# EAGLE schematic TakpadV6.1 (EAGLE 8.4.0)

## Sheet 1 of 2
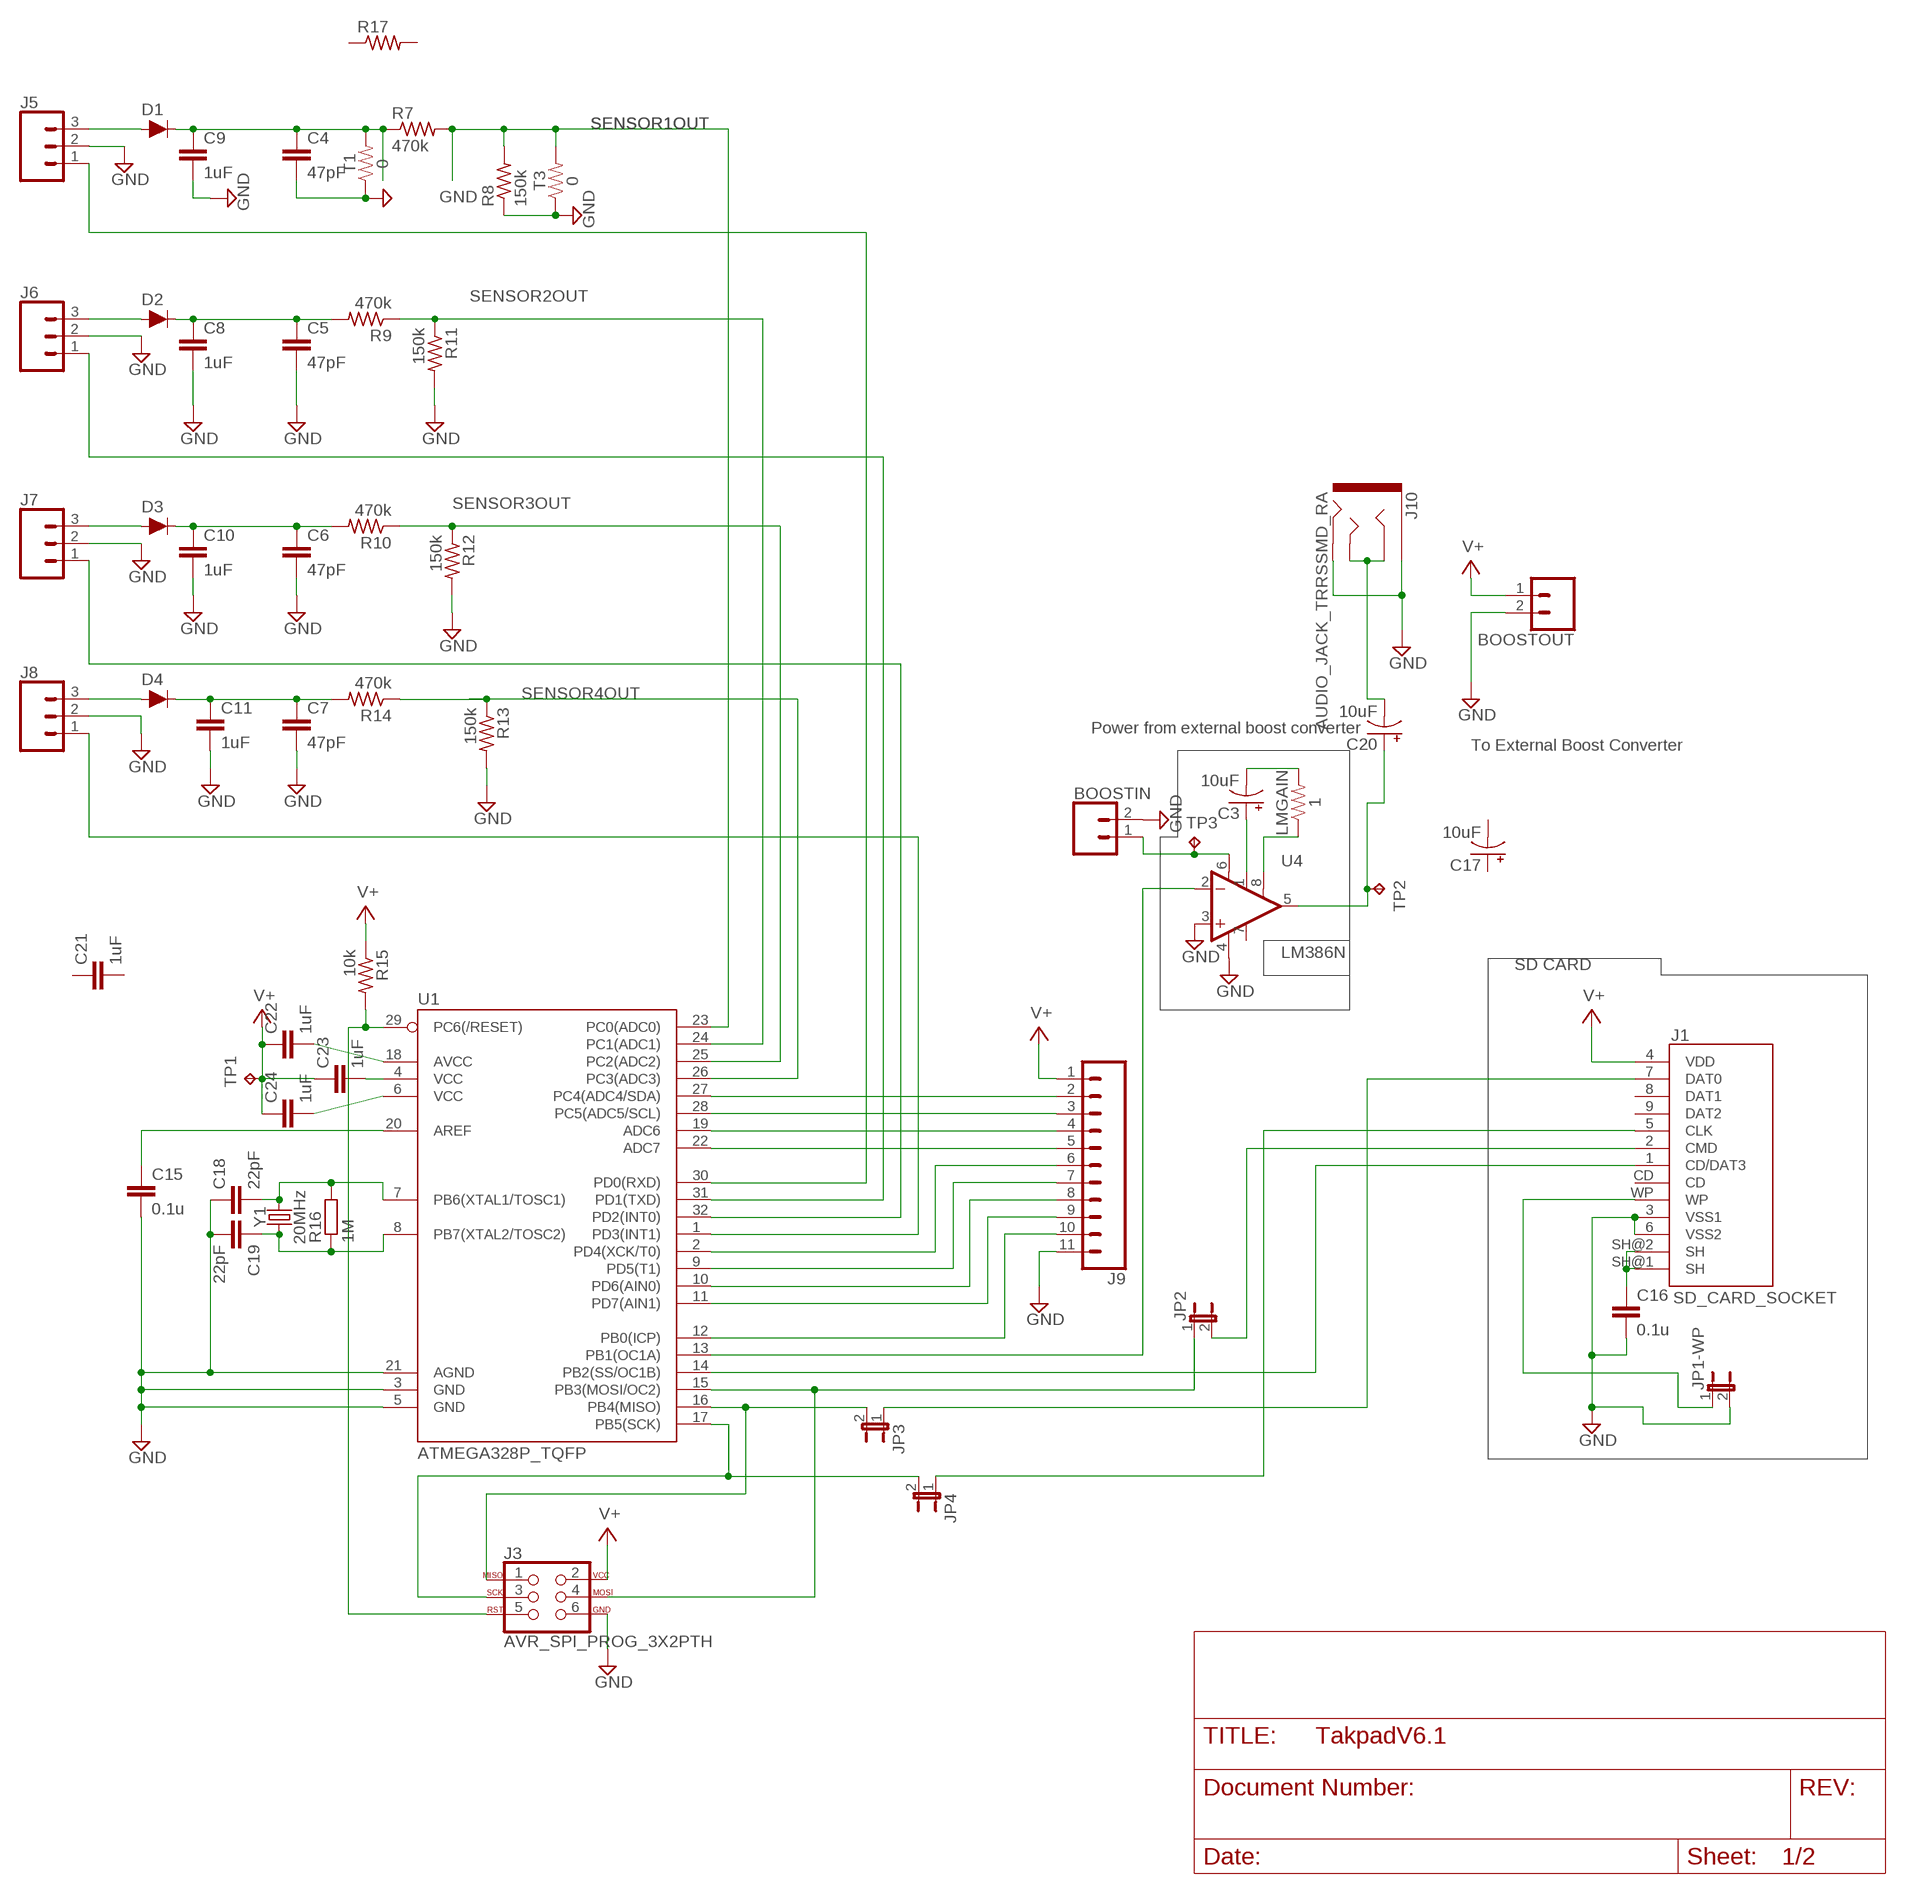
[diagram p0: schematic, sheet 1]

### Parts
BOOSTIN  CONN_02  [1X02]
BOOSTOUT  CONN_02  [1X02]
C3  10uF  10UF-POLAR-RADIAL-2.5MM-KIT-25V-20%  [CPOL-RADIAL-2.5MM-5MM-KIT]
C4  47pF  47PF-0603-50V-5%  [0603]
C5  47pF  47PF-0603-50V-5%  [0603]
C6  47pF  47PF-0603-50V-5%  [0603]
C7  47pF  47PF-0603-50V-5%  [0603]
C8  1uF  47PF-0603-50V-5%  [0603]
C9  1uF  47PF-0603-50V-5%  [0603]
C10  1uF  47PF-0603-50V-5%  [0603]
C11  1uF  47PF-0603-50V-5%  [0603]
C15  0.1u  C-EUC0402  [C0402]
C16  0.1u  C-EUC0402  [C0402]
C17  10uF  10UF-POLAR-RADIAL-2.5MM-KIT-25V-20%  [CPOL-RADIAL-2.5MM-5MM-KIT]
C18  22pF  C-EUC0402  [C0402]
C19  22pF  C-EUC0402  [C0402]
C20  10uF  10UF-POLAR-RADIAL-2.5MM-KIT-25V-20%  [CPOL-RADIAL-2.5MM-5MM-KIT]
C21  1uF  47PF-0603-50V-5%  [0603]
C22  1uF  47PF-0603-50V-5%  [0603]
C23  1uF  47PF-0603-50V-5%  [0603]
C24  1uF  47PF-0603-50V-5%  [0603]
D1  200mA/100V/1V  DIODE-1N4148  [DIODE-1N4148]
D2  200mA/100V/1V  DIODE-1N4148  [DIODE-1N4148]
D3  200mA/100V/1V  DIODE-1N4148  [DIODE-1N4148]
D4  200mA/100V/1V  DIODE-1N4148  [DIODE-1N4148]
J1  SD_CARD_SOCKET  [SD]
J3  AVR_SPI_PROG_3X2PTH  [2X3]
J5  CONN_03  [1X03]
J6  CONN_03  [1X03]
J7  CONN_03  [1X03]
J8  CONN_03  [1X03]
J9  CONN_11  [1X11]
J10  AUDIO_JACK_TRRSSMD_RA  [AUDIO_JACK_3.5MM_TRRS_SMD_RA]
JP1-WP  JUMPER-2PTH  [1X02]
JP2  JUMPER-2PTH  [1X02]
JP3  JUMPER-2PTH  [1X02]
JP4  JUMPER-2PTH  [1X02]
LMGAIN  1  1OHM-0603-1/10W-1%  [0603]
R7  470k  R-US_M1206  [M1206]
R8  150k  R-US_M1206  [M1206]
R9  470k  R-US_M1206  [M1206]
R10  470k  R-US_M1206  [M1206]
R11  150k  R-US_M1206  [M1206]
R12  150k  R-US_M1206  [M1206]
R13  150k  R-US_M1206  [M1206]
R14  470k  R-US_M1206  [M1206]
R15  10k  R-US_M1206  [M1206]
R16  1M  R-EU_R0402  [R0402]
R17  R-US_M1206  [M1206]
T1  0  1KOHM-HORIZ-1/4W-1%  [AXIAL-0.3]
T3  0  1KOHM-HORIZ-1/4W-1%  [AXIAL-0.3]
TP1  TPPAD1-17  [P1-17]
TP2  TPPAD1-17  [P1-17]
TP3  TPPAD1-17  [P1-17]
U1  ATMEGA328P_TQFP  [TQFP32-08]
U4  LM386N  LM386  [DIP08]
Y1  20MHz  CRYSTAL-16MHZPTH-HC49US  [HC49US]

### Nets
ADC4: J9.2 U1.27(PC4(ADC4/SDA))
ADC5: J9.3 U1.28(PC5(ADC5/SCL))
ADC6: J9.4 U1.19(ADC6)
ADC7: J9.5 U1.22(ADC7)
AREF: C15.1 U1.20(AREF)
AUDIOINPUT: U1.13(PB1(OC1A)) U4.2(-IN)
AUDIOOUT: C20.1(+) TP2.TP U4.5(OUT)
CD/DAT3: J1.1(CD/DAT3) U1.14(PB2(SS/OC1B))
CLK: J1.5(CLK) JP4.1
CMD: J1.2(CMD) JP2.2
DAT0: J1.7(DAT0) JP3.1
GND: BOOSTIN.2 BOOSTOUT.2 C4.2 C5.2 C6.2 C7.2 C8.2 C9.2 C10.2 C11.2 C15.2 C16.2 C18.1 C19.2 J1.3(VSS1) J1.6(VSS2) J3.6 J5.2 J6.2 J7.2 J8.2 J9.11 J10.EARTH J10.RING2 JP1-WP.2 R8.1 R11.2 R12.2 R13.2 T1.P$1 T3.P$1 U1.3(GND) U1.5(GND) U1.21(AGND) U4.3(+IN) U4.4(V-) ; also sheet 2
MISO: J3.1 JP3.2 U1.16(PB4(MISO))
MOSI: J3.4 JP2.1 U1.15(PB3(MOSI/OC2))
N$1: C20.2(-) J10.RING1 J10.TIP
N$2: C23.2 U1.4(VCC)
N$3: C22.2 U1.18(AVCC)
N$4: C24.2 U1.6(VCC)
N$9: C3.1(+) U4.1(GAIN)
N$10: C3.2(-) LMGAIN.2
N$11: LMGAIN.1 U4.8(GAIN)
N$17: C16.1 J1.SH@1(SH) J1.SH@2(SH)
PB6: C18.2 R16.2 U1.7(PB6(XTAL1/TOSC1)) Y1.2
PB7: C19.1 R16.1 U1.8(PB7(XTAL2/TOSC2)) Y1.1
PD4: J9.6 U1.2(PD4(XCK/T0))
PD5: J9.7 U1.9(PD5(T1))
PD6: J9.8 U1.10(PD6(AIN0))
PD7: J9.9 U1.11(PD7(AIN1))
PD8: J9.10 U1.12(PB0(ICP))
RST: J3.5 R15.2 U1.29(PC6(/RESET))
SCK: J3.3 JP4.2 U1.17(PB5(SCK))
SENS1LED: J5.1 U1.30(PD0(RXD))
SENS2LED: J6.1 U1.31(PD1(TXD))
SENS3LED: J7.1 U1.32(PD2(INT0))
SENS4LED: J8.1 U1.1(PD3(INT1))
SENSOR1: D1.A J5.3
SENSOR1IN: C4.1 C9.1 D1.C R7.1 T1.P$2
SENSOR1OUT: R7.2 R8.2 T3.P$2 U1.23(PC0(ADC0))
SENSOR2: D2.A J6.3
SENSOR2IN: C5.1 C8.1 D2.C R9.2
SENSOR2OUT: R9.1 R11.1 U1.24(PC1(ADC1))
SENSOR3: D3.A J7.3
SENSOR3IN: C6.1 C10.1 D3.C R10.2
SENSOR3OUT: R10.1 R12.1 U1.25(PC2(ADC2))
SENSOR4: D4.A J8.3
SENSOR4IN: C7.1 C11.1 D4.C R14.2
SENSOR4OUT: R13.1 R14.1 U1.26(PC3(ADC3))
UPCONVERTERINPUT: BOOSTIN.1 TP3.TP U4.6(V+)
V+: BOOSTOUT.1 C22.1 C23.1 C24.1 J1.4(VDD) J3.2 J9.1 R15.1 TP1.TP ; also sheet 2
WP: J1.WP JP1-WP.1
Unconnected: C17.1(+) C17.2(-) C21.1 C21.2 J1.8(DAT1) J1.9(DAT2) J1.CD R17.1 R17.2 U4.7(BP)

### Notes on the sheet
- Power from external boost converter
- To External Boost Converter
- SD CARD

## Sheet 2 of 2
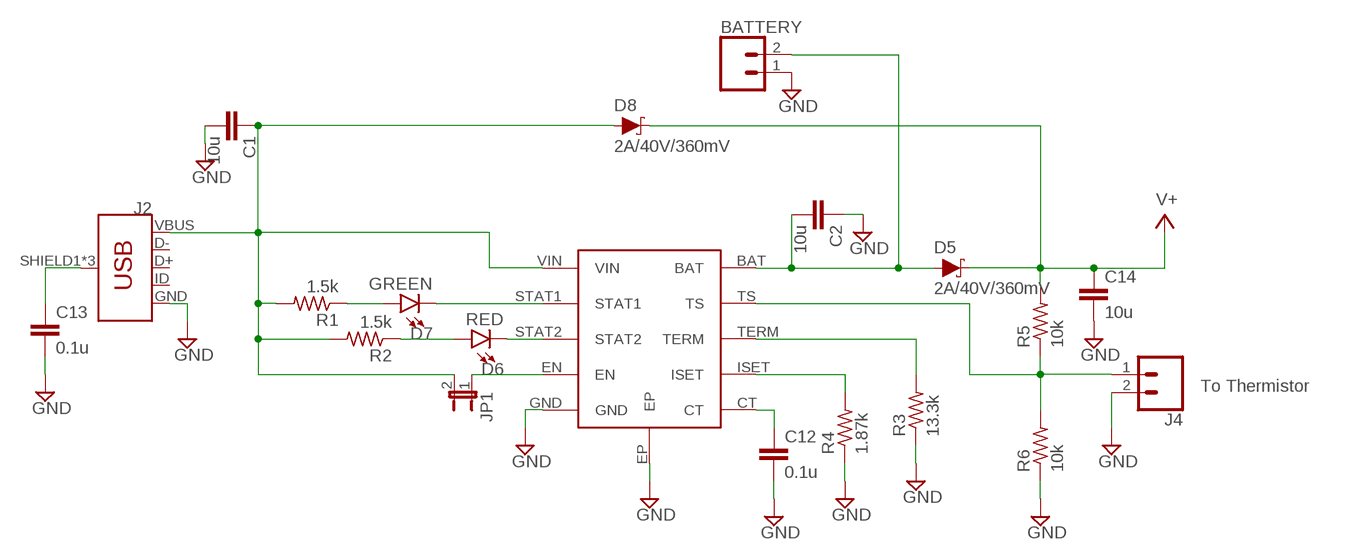
[diagram p1: schematic, sheet 2]

### Parts
BATTERY  CONN_02  [1X02]
C1  10u  C-EUC0402  [C0402]
C2  10u  C-EUC0402  [C0402]
C12  0.1u  C-EUC0402  [C0402]
C13  0.1u  C-EUC0402  [C0402]
C14  10u  C-EUC0402  [C0402]
D5  2A/40V/360mV  DIODE-SCHOTTKY-B340A  [SMA-DIODE]
D6  RED  LED-RED1206  [LED-1206]
D7  GREEN  LED-GREEN1206  [LED-1206]
D8  2A/40V/360mV  DIODE-SCHOTTKY-B340A  [SMA-DIODE]
J2  USB_MICRO-BREDUCED_PASTE  [USB-B-MICRO-SMD_RED_PASTE]
J4  CONN_02  [1X02]
JP1  JUMPER-2PTH  [1X02]
R1  1.5k  R-US_M1206  [M1206]
R2  1.5k  R-US_M1206  [M1206]
R3  13.3k  R-US_M1206  [M1206]
R4  1.87k  R-US_M1206  [M1206]
R5  10k  R-US_M1206  [M1206]
R6  10k  R-US_M1206  [M1206]
U$1  AAT3693  [IDH-AA-T1]

### Nets
BAT: BATTERY.2 C2.2 D5.A U$1.BAT
CT: C12.1 U$1.CT
EN: JP1.1 U$1.EN
GND: BATTERY.1 C1.2 C2.1 C12.2 C13.2 C14.2 J2.GND J4.2 R3.1 R4.1 R6.1 U$1.EP U$1.GND ; also sheet 1
ISET: R4.2 U$1.ISET
N$7: C13.1 J2.SHIELD1(SHIELD) J2.SHIELD2(SHIELD) J2.SHIELD3(SHIELD)
STAT1: D7.C U$1.STAT1
STAT1LED: D7.A R1.1
STAT2: D6.C U$1.STAT2
STAT2LED: D6.A R2.1
TEMPSENSE: J4.1 R5.1 R6.2 U$1.TS
TERM: R3.2 U$1.TERM
V+: C14.1 D5.C D8.C R5.2 ; also sheet 1
VIN: C1.1 D8.A J2.VBUS JP1.2 R1.2 R2.2 U$1.VIN
Unconnected: J2.D+ J2.D- J2.ID

### Notes on the sheet
- To Thermistor

## Library data of the parts
BATTERY BOOSTIN BOOSTOUT J4 = SparkFun-Connectors:CONN_02: Multi connection point. Often used as Generic Header-pin footprint for 0.1 inch spaced/style header connections On any of the 0.1 inch spaced packages, you can populate with these: Break Away Headers - Straight <https://www.sparkfun.com/products/116> (PRT-00116) Break Away Male Headers - Right Angle <https://www.sparkfun.com/products/553> (PRT-00553) Female Headers <https://www.sparkfun.com/products/115> (PRT-00115) Break Away Headers - Machine Pin <https://www.sparkfun.com/products/117> (PRT-00117) Break Away Female Headers - Swiss Machine Pin <https://www.sparkfun.com/products/743> (PRT-00743) For SCREWTERMINALS and SPRING TERMINALS visit here: Screw Terimnals on SparkFun.com <https://www.sparkfun.com/search/results?term=Screw+Terminals> (5mm/3.5mm/2.54mm spacing) This device is also useful as a general connection point to wire up your design to another part of your project. Our various solder wires solder well into these plated through hole pads. Hook-Up Wire - Assortment (Stranded, 22 AWG) <https://www.sparkfun.com/products/11375> (PRT-11375) Hook-Up Wire - Assortment (Solid Core, 22 AWG) <https://www.sparkfun.com/products/11367> (PRT-11367) View the entire wire category on our website here <https://www.sparkfun.com/categories/141> Special notes: Molex polarized connector foot print use with: PRT-08233 with associated crimp pins and housings. 2.54_SCREWTERM for use with PRT-10571. 3.5mm Screw Terminal footprints for PRT-08084 5mm Screw Terminal footprints for use with PRT-08432
C1 C2 C12-C16 = rcl:C-EU: CAPACITOR, European symbol
C3 C17 C20 = SparkFun-Capacitors:10UF-POLAR: 10.0µF polarized capacitors A capacitor is a passive two-terminal electrical component used to store electrical energy temporarily in an electric field.; PROD_ID: CAP-08440
C4-C7 = SparkFun-Capacitors:47PF: 47pF ceramic capacitors A capacitor is a passive two-terminal electrical component used to store electrical energy temporarily in an electric field.; PROD_ID: CAP-08913
C8-C11 C21-C24 = SparkFun-Capacitors:47PF: 47pF ceramic capacitors A capacitor is a passive two-terminal electrical component used to store electrical energy temporarily in an electric field.; PROD_ID: CAP-08913; VALUE: 47pF
C18 C19 = resistor:C-EU: CAPACITOR, European symbol
D1-D4 = SparkFun-DiscreteSemi:DIODE: Diode These are standard reverse protection diodes and small signal diodes. SparkFun Products: SparkFun SparkPunk Sound Kit <https://www.sparkfun.com/products/11177> SparkFun ESP8266 Thing <https://www.sparkfun.com/products/13231>; PROD_ID: DIO-08378
D5 D8 = SparkFun-DiscreteSemi:DIODE-SCHOTTKY: Schottky diode A Schottky diode is a semiconductor diode which has a low forward voltage drop and a very fast switching action.; PROD_ID: DIO-09886; VALUE: 3A/40V/500mV
D6 = SparkFun-LED:LED-RED: Red SMD LED Used in manufacturing of most products at SparkFun Packages: 0603 - SMD 0603 package [Product Link] <http://docs.avagotech.com/docs/AV02-0551EN> 0603 SMART - SMD 0603 SMART package ( more efficient and expensive)[Product Link] <http://www.osram-os.com/Graphics/XPic2/00077099_0.pdf> 1206 - SMD1206 package [Product Link] <https://www.sparkfun.com/datasheets/DevTools/LilyPad/Q150OVS4.pdff> SparkFun Products: Pro Mini 328 -5V <https://www.sparkfun.com/products/821> RedBoard <https://www.sparkfun.com/products/12757> IOIO-OTG <https://www.sparkfun.com/products/13613>; PROD_ID: DIO-09912
D7 = SparkFun-LED:LED-GREEN: Green SMD LED Used in manufacturing of various products at SparkFun Packages: 0603 - SMD 0603 package [Product Link] <http://www.futureelectronics.com/en/technologies/semiconductors/optoelectronics/leds/Pages/9894312-LTST-C190GKT.aspx?CrossPart=HSMG-C190&IM=0> LilyPad 1206 - SMD1206 LilyPad package [Product Link] <http://www.futureelectronics.com/en/Technologies/Product.aspx?ProductID=IN150NGHARVATEKCORPORATION2049943&IM=0> 1206 - SMD1206 package [Product Link] <http://www.futureelectronics.com/en/technologies/semiconductors/optoelectronics/leds/Pages/8315665-LTST-C150KGKT.aspx?IM=0> 1206 Bottom Mount -SMD 1206 Bottom Mount [Product Link] <http://www.digikey.com/product-detail/en/lite-on-inc/LTST-C230KGKT/160-1456-1-ND/386854> SparkFun Products: Pro Mini 328 -5V <https://www.sparkfun.com/products/821> RedBoard <https://www.sparkfun.com/products/12757> MP3 Trigger <https://www.sparkfun.com/products/13720> Makey Makey <https://www.sparkfun.com/products/11076>; PROD_ID: DIO-00862
J1 = SparkFun-Connectors:SD_CARD_SOCKET: SD Memory Card Connector (standard "large" size) Push-push normal type, CD enable, WP enable. Here is the connector we sell at SparkFun: SD/MMC Socket <https://www.sparkfun.com/products/12769> (PRT-12769) Datasheet <https://cdn.sparkfun.com/datasheets/Prototyping/19608.pdf> It is used on these SparkFun products: SparkFun SD/MMC Card Breakout <https://www.sparkfun.com/products/12941> (BOB-12941) SD Sniffer <https://www.sparkfun.com/products/11468> (TOL-11468); PROD_ID: CONN-11976; SF_ID: PRT-12769
J2 = SparkFun-Connectors:USB_MICRO-B: USB Type Micro-B Connector Male/female and PTH/SMT variants SparkFun Products: SparkFun microB USB Breakout <https://www.sparkfun.com/products/12035> SparkFun USB microB Plug Breakout <https://www.sparkfun.com/products/10031> SparkFun ESP8266 Thing <https://www.sparkfun.com/products/13231>; PROD_ID: CONN-11752
J3 = SparkFun-Connectors:AVR_SPI_PROG_3X2: AVR ISP 6 Pin This is the reduced ISP connector for AVR programming. Common on Arduino. This footprint will take up less PCB space and can be used with a 10-pin to 6-pin adapter such as SKU: BOB-08508 **Special note about "TEST_POINT" package. The stop mask is on the top side, so if you want your programming test points to be on the bottom of your board, make sure to place this package on the bottom side of the board. This also ensure that the orientation to program from the bottom side will be correct. SparkFun Products: SparkFun ISP Pogo Adapter <https://www.sparkfun.com/products/11591> - NS Tiny AVR Programmer <https://www.sparkfun.com/products/11801> -PTH
J5-J8 = SparkFun-Connectors:CONN_03: Multi connection point. Often used as Generic Header-pin footprint for 0.1 inch spaced/style header connections On any of the 0.1 inch spaced packages, you can populate with these: Break Away Headers - Straight <https://www.sparkfun.com/products/116> (PRT-00116) Break Away Male Headers - Right Angle <https://www.sparkfun.com/products/553> (PRT-00553) Female Headers <https://www.sparkfun.com/products/115> (PRT-00115) Break Away Headers - Machine Pin <https://www.sparkfun.com/products/117> (PRT-00117) Break Away Female Headers - Swiss Machine Pin <https://www.sparkfun.com/products/743> (PRT-00743) Stackable Header - 3 Pin (Female, 0.1") <https://www.sparkfun.com/products/13875> (PRT-13875) For SCREWTERMINALS and SPRING TERMINALS visit here: Screw Terimnals on SparkFun.com <https://www.sparkfun.com/search/results?term=Screw+Terminals> (5mm/3.5mm/2.54mm spacing) This device is also useful as a general connection point to wire up your design to another part of your project. Our various solder wires solder well into these plated through hole pads. Hook-Up Wire - Assortment (Stranded, 22 AWG) <https://www.sparkfun.com/products/11375> (PRT-11375) Hook-Up Wire - Assortment (Solid Core, 22 AWG) <https://www.sparkfun.com/products/11367> (PRT-11367) View the entire wire category on our website here <https://www.sparkfun.com/categories/141> Special notes: Molex polarized connector foot print use with SKU : PRT-08232 with associated crimp pins and housings.
J9 = SparkFun-Connectors:CONN_11: Multi connection point. Often used as Generic Header-pin footprint for 0.1 inch spaced/style header connections On any of the 0.1 inch spaced packages, you can populate with these: Break Away Headers - Straight <https://www.sparkfun.com/products/116> (PRT-00116) Break Away Male Headers - Right Angle <https://www.sparkfun.com/products/553> (PRT-00553) Female Headers <https://www.sparkfun.com/products/115> (PRT-00115) Break Away Headers - Machine Pin <https://www.sparkfun.com/products/117> (PRT-00117) Break Away Female Headers - Swiss Machine Pin <https://www.sparkfun.com/products/743> (PRT-00743) For SCREWTERMINALS and SPRING TERMINALS visit here: Screw Terimnals on SparkFun.com <https://www.sparkfun.com/search/results?term=Screw+Terminals> (5mm/3.5mm/2.54mm spacing) This device is also useful as a general connection point to wire up your design to another part of your project. Our various solder wires solder well into these plated through hole pads. Hook-Up Wire - Assortment (Stranded, 22 AWG) <https://www.sparkfun.com/products/11375> (PRT-11375) Hook-Up Wire - Assortment (Solid Core, 22 AWG) <https://www.sparkfun.com/products/11367> (PRT-11367) View the entire wire category on our website here <https://www.sparkfun.com/categories/141>
J10 = SparkFun-Connectors:AUDIO_JACK_TRRS: Audio Jack - 3.5mm TRRS (SMD) This is a 3.5mm TRRS SMD audio jack. TRRS connectors are the audio-style connectors that you see on some phones, MP3 players and development boards. TRRS stands for “tip, ring, ring, sleeve,” which reflects that this has three conductors and a ground. SparkFun Products: Audio Jack <https://www.sparkfun.com/products/12639> mbed Starter Kit <https://www.sparkfun.com/products/12968> SparkFun TRRS 3.5mm Jack Breakout <https://www.sparkfun.com/products/11570>; PROD_ID: CONN-10676; SF_ID: PRT-12639
JP1 JP1-WP JP2-JP4 = SparkFun-Retired:JUMPER-2: Jumper Basic 0.1" spaced jumper. Use with breakaway headers.
LMGAIN = SparkFun-Resistors:1OHM: 1Ω resistor A resistor is a passive two-terminal electrical component that implements electrical resistance as a circuit element. Resistors act to reduce current flow, and, at the same time, act to lower voltage levels within circuits. - Wikipedia; PROD_ID: RES-08269
R1-R15 R17 = rcl:R-US_: RESISTOR, American symbol
R16 = rcl:R-EU_: RESISTOR, European symbol
T1 T3 = SparkFun-Resistors:1KOHM: 1kΩ resistor A resistor is a passive two-terminal electrical component that implements electrical resistance as a circuit element. Resistors act to reduce current flow, and, at the same time, act to lower voltage levels within circuits. - Wikipedia; PROD_ID: RES-12182; VALUE: 1k
TP1-TP3 = testpad:TP: Test pad
U1 = SparkFun-IC-Microcontroller:ATMEGA328P_TQFP: Popular 328P in QFP Storefront component: ATmega328 - TQFP <https://www.sparkfun.com/products/13448> (COM-13448) Datasheet <http://www.sparkfun.com/datasheets/Components/SMD/ATMega328.pdf> SparkFun Products SparkFun RedBoard - Programmed with Arduino <https://www.sparkfun.com/products/12757> (DEV-12757) Arduino Pro Mini 328 - 5V/16MHz <https://www.sparkfun.com/products/11113> (DEV-11113) Arduino Pro Mini 328 - 3.3V/8MHz <https://www.sparkfun.com/products/11114> (DEV-11114) SparkFun OpenLog <https://www.sparkfun.com/products/13712> (DEV-13712) SparkFun MicroView - OLED Arduino Module <https://www.sparkfun.com/products/12923> (DEV-12923) SparkFun Digital Sandbox <https://www.sparkfun.com/products/12651> (DEV-12651) SparkFun PicoBoard <https://www.sparkfun.com/products/11888> (WIG-11888) Arduino Fio <https://www.sparkfun.com/products/10116> (DEV-10116) LilyPad Arduino 328 Main Board <https://www.sparkfun.com/products/13342> (DEV-13342) SparkFun RedStick <https://www.sparkfun.com/products/13741> (DEV-13741) LilyPad MP3 <https://www.sparkfun.com/products/11013> (DEV-11013) LilyPad Arduino SimpleSnap <https://www.sparkfun.com/products/10941> (DEV-10941) SparkFun Stepoko <https://www.sparkfun.com/products/13899> (ROB-13899) SparkFun Geiger Counter <https://www.sparkfun.com/products/11345> (SEN-11345) SparkFun EL Sequencer <https://www.sparkfun.com/products/12781> (COM-12781) Arduino Pro 328 - 5V/16MHz <https://www.sparkfun.com/products/10915> (DEV-10915) CryptoCape <https://www.sparkfun.com/products/12773> (DEV-12773) SparkFun IR Thermometer Evaluation Board - MLX90614 <https://www.sparkfun.com/products/10740> (SEN-10740) SparkFun RedBot Mainboard <https://www.sparkfun.com/products/12097> (ROB-12097) Arduino Pro 328 - 3.3V/8MHz <https://www.sparkfun.com/products/10914> (DEV-10914) SparkFun Block for Intel® Edison - Arduino <https://www.sparkfun.com/products/13036> (DEV-13036) SparkFun Simon Says - Surface Mount Soldering Kit <https://www.sparkfun.com/products/10935> (KIT-10935) SparkFun 7-Segment Serial Display - Red <https://www.sparkfun.com/products/11441> (COM-11441) SparkFun 7-Segment Serial Display - White <https://www.sparkfun.com/products/11629> (COM-11629) SparkFun 7-Segment Serial Display - Yellow <https://www.sparkfun.com/products/11443> (COM-11443) SparkFun 7-Segment Serial Display - Kelly Green <https://www.sparkfun.com/products/11440> (COM-11440) SparkFun 7-Segment Serial Display - Blue <https://www.sparkfun.com/products/11442> (COM-11442) SparkFun OpenSegment Serial Display - 20mm (Blue) <https://www.sparkfun.com/products/11647> (COM-11647) SparkFun OpenSegment Serial Display - 20mm (Green) <https://www.sparkfun.com/products/11646> (COM-11646) SparkFun OpenSegment Serial Display - 20mm (White) <https://www.sparkfun.com/products/11648> (COM-11648) SparkFun OpenSegment Serial Display - 20mm (Red) <https://www.sparkfun.com/products/11644> (COM-11644) SparkFun OpenSegment Serial Display - 20mm (Yellow) <https://www.sparkfun.com/products/11645> (COM-11645) SparkFun OpenSegment Shield <https://www.sparkfun.com/products/13190> (DEV-13190); PROD_ID: IC-09069
U4 = SparkFun-IC-Amplifiers:LM386: low voltage audio power amplifier SparkFun Products FabFM Radio Kit <https://www.sparkfun.com/products/11043> (KIT-11043); PROD_ID: IC-10899
U$1 = AAT3693:AAT3693
Y1 = SparkFun-Clocks:CRYSTAL-16MHZ: 16MHz Crystal Digikey Example <http://www.digikey.com/product-search/en?keywords=535-9122-1-ND> Frequency: 16MHz Frequency Stability: ±50ppm Frequency Tolerance: ±20ppm Load Capacitance: 18pF SparkFun Products: Pro Micro -5V/16MHz <https://www.sparkfun.com/products/12640> SparkFun Serial Enabled LCD Kit <https://www.sparkfun.com/products/10097>; PROD_ID: XTAL-08181; SF_ID: COM-00536; VALUE: 16MHz